# Altium schematic sheet Motor-E2.SchDoc: Motor-E2
size Letter; DocumentNumber: 3; SheetNumber: 9; SheetTotal: 11
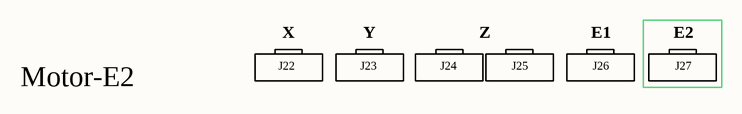
[diagram p0: Motor-E2.SchDoc]

## Notes on the sheet
- X
- Y
- Z
- E1
- E2
- Motor-E2
- J22
- J23
- J24
- J25
- J26
- J27